# Altium schematic sheet SoM.SchDoc
size 420 x 297 mm; SheetNumber: 2; SheetTotal: 8
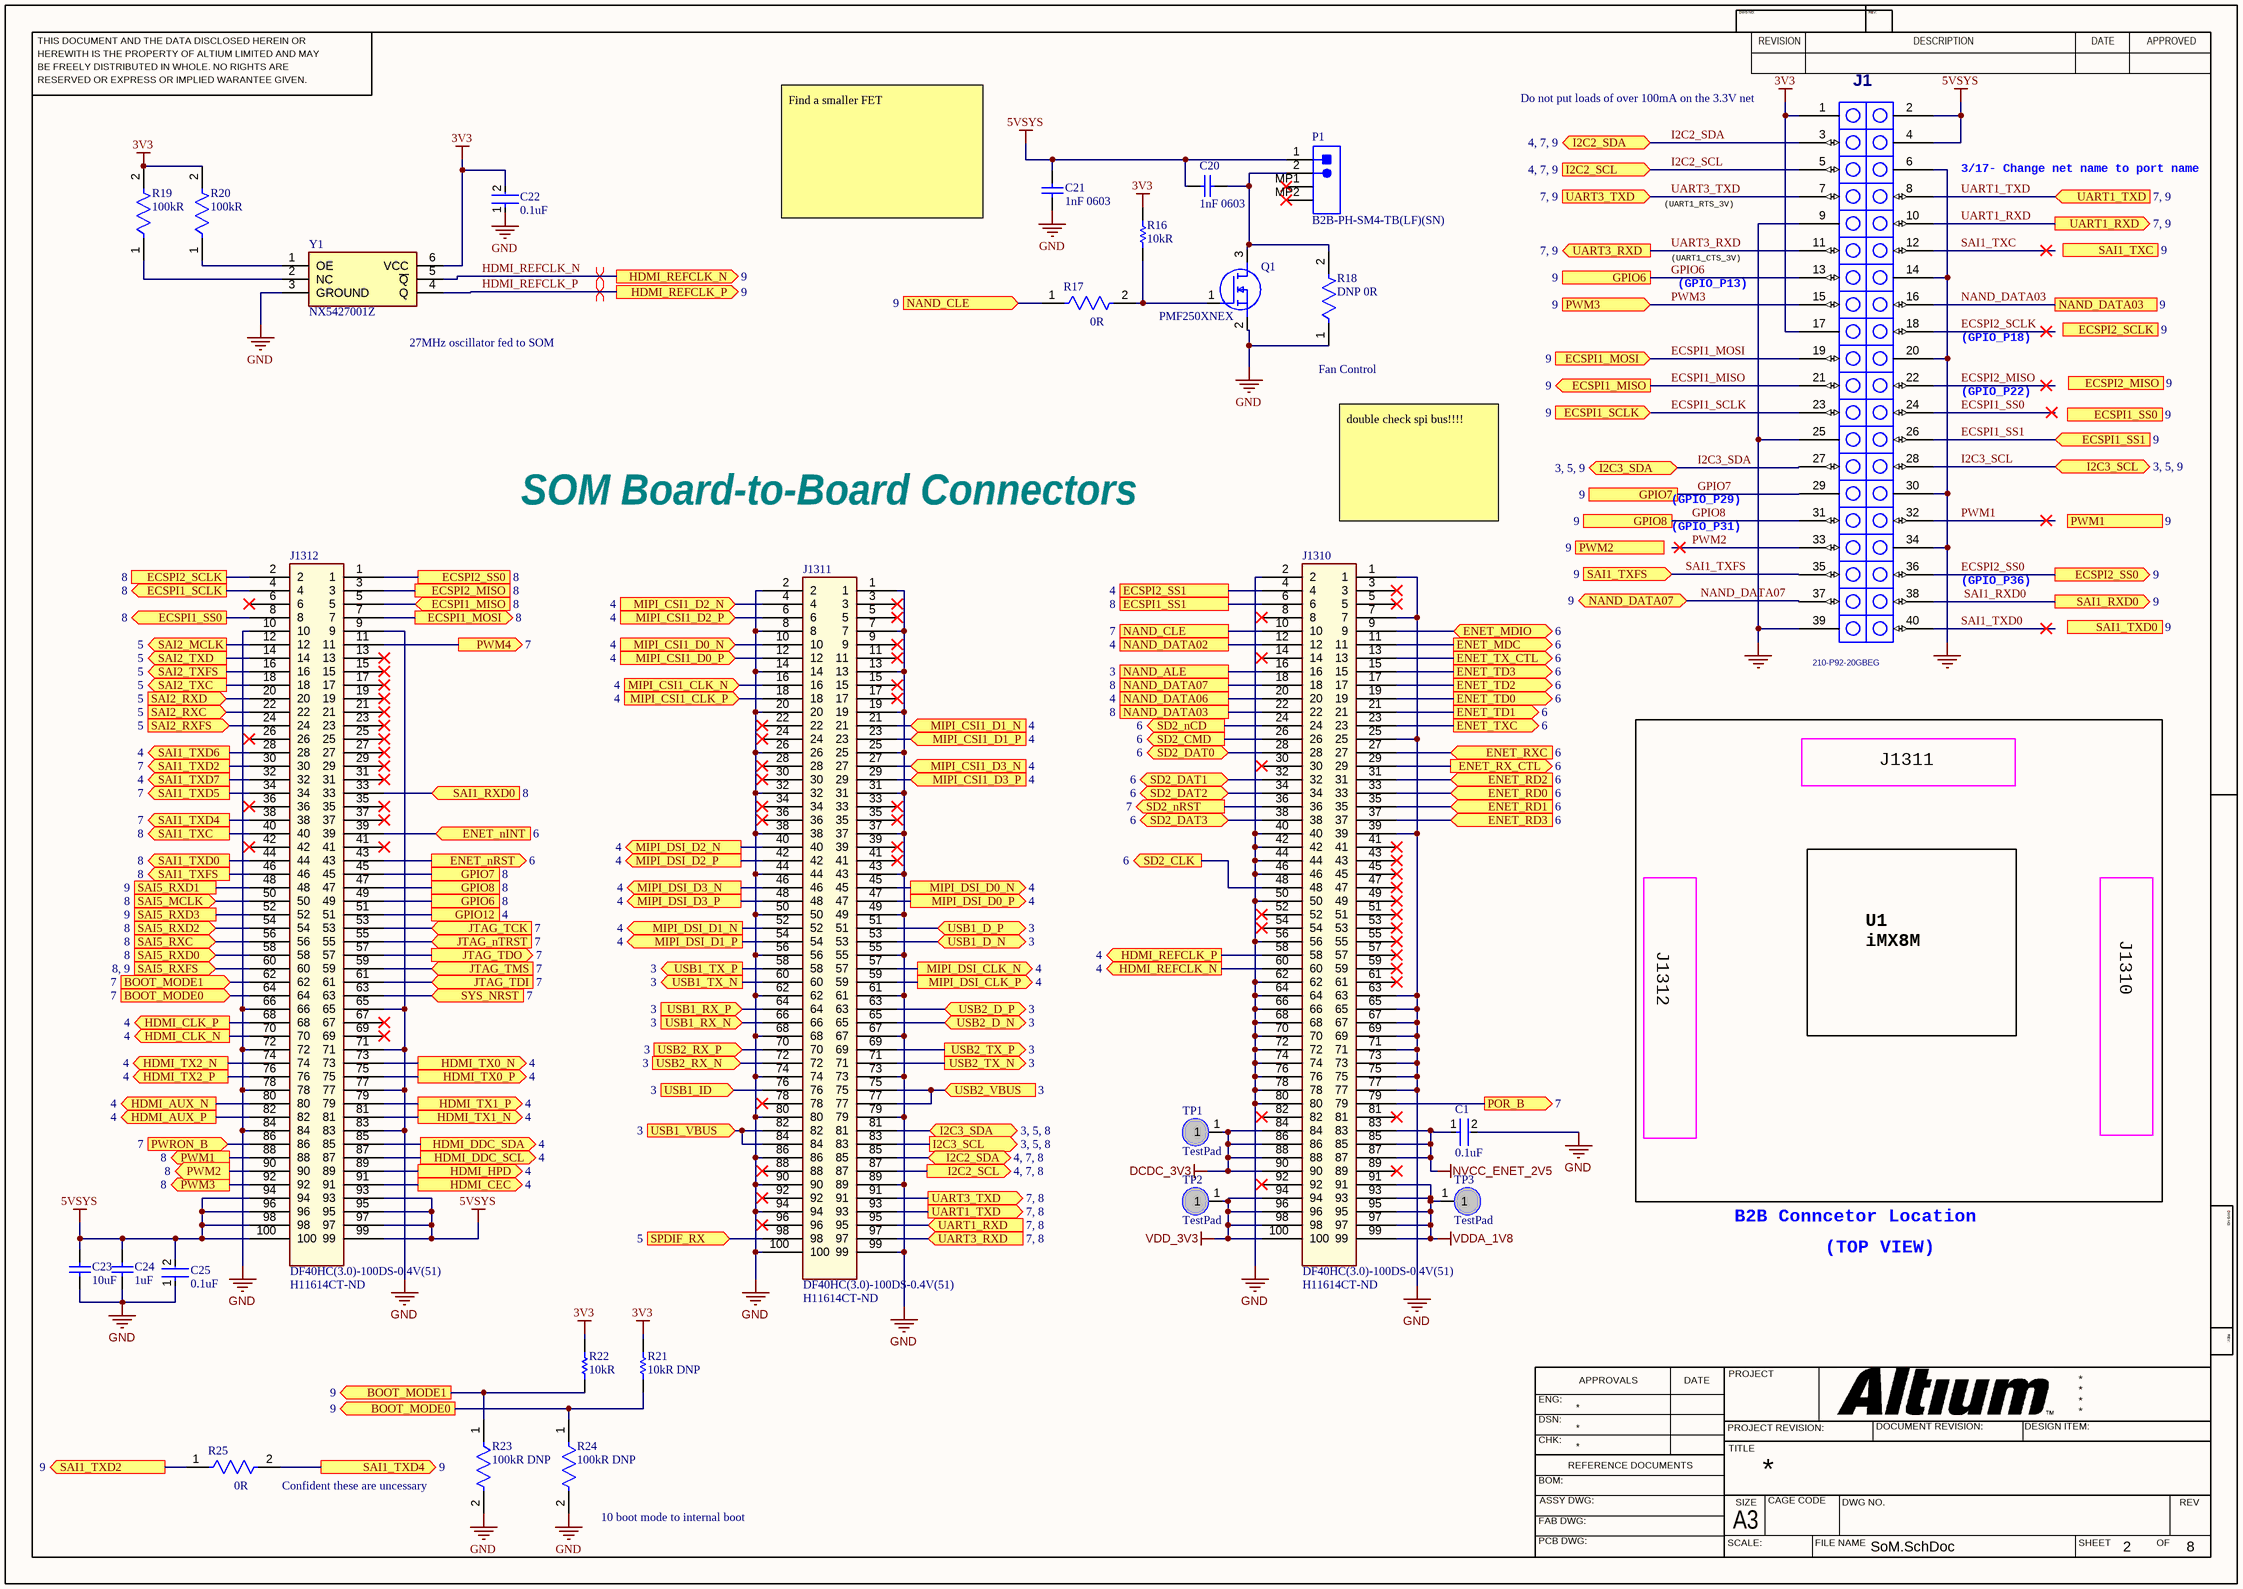
[diagram p0: SoM.SchDoc]

## Parts
C1  0.1uF  [FP-C0603-CJ-MFG]
C20  1nF 0603  [CAPC1608X90X35LL15T15]
C21  1nF 0603  [CAPC1608X90X35LL15T15]
C22  0.1uF  [FP-C0603-CJ-MFG]
C23  10uF  [CAPC2013X145X20ML20]
C24  1uF  [CAPC2013X145X50LL20T25]
C25  0.1uF  [FP-C0603-CJ-MFG]
J1  210-P92-20GBEG  [2X20]
J1310  DF40HC(3.0)-100DS-0.4V(51)  Supplier Part Number 1: H11614CT-ND  [DF40HC30100DS04V51]
J1311  DF40HC(3.0)-100DS-0.4V(51)  Supplier Part Number 1: H11614CT-ND  [DF40HC30100DS04V51]
J1312  DF40HC(3.0)-100DS-0.4V(51)  Supplier Part Number 1: H11614CT-ND  [DF40HC30100DS04V51]
P1  B2B-PH-SM4-TB(LF)(SN)  [JST-B2B-PH-SM4-TB-2_V]
Q1  PMF250XNEX  [SOT65P210X110-3N]
R16  10kR  [RESC2013X60X35NL10T20]
R17  0R  [FP-RC1206-MFG]
R18  DNP 0R  [FP-RC1206-MFG]
R19  100kR  [FP-RC0603-0_55-MFG]
R20  100kR  [FP-RC0603-0_55-MFG]
R21  10kR DNP  [RESC2013X60X35NL10T20]
R22  10kR  [RESC2013X60X35NL10T20]
R23  100kR DNP  [FP-RC0603-0_55-MFG]
R24  100kR DNP  [FP-RC0603-0_55-MFG]
R25  0R  [FP-RC1206-MFG]
TP1  TestPad  [TestPad50mil]
TP2  TestPad  [TestPad50mil]
TP3  TestPad  [TestPad50mil]
Y1  NX5427001Z  [NX5427001Z]

## Ports
BOOT_MODE0 (in, see 7), BOOT_MODE0 (out, see 9), BOOT_MODE1 (in, see 7), BOOT_MODE1 (out, see 9), ECSPI1_MISO (in, see 8), ECSPI1_MISO (out, see 9), ECSPI1_MOSI (in, see 9), ECSPI1_MOSI (out, see 8), ECSPI1_SCLK (in, see 9), ECSPI1_SCLK (out, see 8), ECSPI1_SS0 (in, see 9), ECSPI1_SS0 (out, see 8), ECSPI1_SS1 (in, see 9), ECSPI1_SS1 (see 8), ECSPI2_MISO (see 8), ECSPI2_MISO (see 9), ECSPI2_SCLK (see 8), ECSPI2_SCLK (see 9), ECSPI2_SS0 (out, see 9), ECSPI2_SS0 (see 8), ECSPI2_SS1 (see 4), ENET_MDC (out, see 6), ENET_MDIO (bidir, see 6), ENET_nINT (in, see 6), ENET_nRST (out, see 6), ENET_RD0 (in, see 6), ENET_RD1 (in, see 6), ENET_RD2 (in, see 6), ENET_RD3 (in, see 6), ENET_RX_CTL (out, see 6), ENET_RXC (in, see 6), ENET_TD0 (out, see 6), ENET_TD1 (out, see 6), ENET_TD2 (out, see 6), ENET_TD3 (out, see 6), ENET_TX_CTL (out, see 6), ENET_TXC (out, see 6), GPIO6 (see 8), GPIO6 (see 9), GPIO7 (see 8), GPIO7 (see 9), GPIO8 (see 8), GPIO8 (see 9), GPIO12 (see 4), HDMI_AUX_N (out, see 4), HDMI_AUX_P (out, see 4), HDMI_CEC (out, see 4), HDMI_CLK_N (out, see 4), HDMI_CLK_P (out, see 4), HDMI_DDC_SCL (out, see 4), HDMI_DDC_SDA (out, see 4), HDMI_HPD (out, see 4), HDMI_REFCLK_N (out, see 4), HDMI_REFCLK_N (out, see 9), HDMI_REFCLK_P (out, see 4), HDMI_REFCLK_P (out, see 9), HDMI_TX0_N (out, see 4), HDMI_TX0_P (out, see 4), HDMI_TX1_N (out, see 4), HDMI_TX1_P (out, see 4), HDMI_TX2_N (out, see 4), HDMI_TX2_P (out, see 4), I2C2_SCL (in, see 4, 7, 9), I2C2_SCL (out, see 4, 7, 8), I2C2_SDA (bidir, see 4, 7, 8), I2C2_SDA (bidir, see 4, 7, 9), I2C3_SCL (bidir, see 3, 5, 9), I2C3_SCL (out, see 3, 5, 8), I2C3_SDA (bidir, see 3, 5, 8), I2C3_SDA (bidir, see 3, 5, 9), JTAG_nTRST (in, see 7), JTAG_TCK (in, see 7), JTAG_TDI (in, see 7), JTAG_TDO (out, see 7), JTAG_TMS (in, see 7), MIPI_CSI1_CLK_N (in, see 4), MIPI_CSI1_CLK_P (in, see 4), MIPI_CSI1_D0_N (in, see 4), MIPI_CSI1_D0_P (in, see 4), MIPI_CSI1_D1_N (in, see 4), MIPI_CSI1_D1_P (in, see 4), MIPI_CSI1_D2_N (in, see 4), MIPI_CSI1_D2_P (in, see 4), MIPI_CSI1_D3_N (in, see 4), MIPI_CSI1_D3_P (in, see 4), MIPI_DSI_CLK_N (out, see 4), MIPI_DSI_CLK_P (out, see 4), MIPI_DSI_D0_N (out, see 4), MIPI_DSI_D0_P (out, see 4), MIPI_DSI_D1_N (out, see 4), MIPI_DSI_D1_P (out, see 4), MIPI_DSI_D2_N (out, see 4), MIPI_DSI_D2_P (out, see 4), MIPI_DSI_D3_N (out, see 4), MIPI_DSI_D3_P (out, see 4), NAND_ALE (see 3), NAND_CLE (in, see 9), NAND_CLE (see 7), NAND_DATA02 (see 4), NAND_DATA03 (see 8), NAND_DATA03 (see 9), NAND_DATA06 (see 4), NAND_DATA07 (bidir, see 9), NAND_DATA07 (see 8), POR_B (out, see 7), PWM1 (in, see 9), PWM1 (out, see 8), PWM2 (in, see 9), PWM2 (out, see 8), PWM3 (in, see 9), PWM3 (out, see 8), PWM4 (out, see 7), PWRON_B (in, see 7), SAI1_RXD0 (in, see 8), SAI1_RXD0 (out, see 9), SAI1_TXC (in, see 9), SAI1_TXC (out, see 8), SAI1_TXD0 (out, see 8), SAI1_TXD0 (out, see 9), SAI1_TXD2 (out, see 7), SAI1_TXD2 (out, see 9), SAI1_TXD4 (out, see 7), SAI1_TXD4 (out, see 9), SAI1_TXD5 (out, see 7), SAI1_TXD6 (out, see 4), SAI1_TXD7 (out, see 4), SAI1_TXFS (in, see 9), SAI1_TXFS (out, see 8), SAI2_MCLK (out, see 5), SAI2_RXC (in, see 5), SAI2_RXD (in, see 5), SAI2_RXFS (in, see 5), SAI2_TXC (out, see 5), SAI2_TXD (out, see 5), SAI2_TXFS (out, see 5), SAI5_MCLK (in, see 8), SAI5_RXC (in, see 8), SAI5_RXD0 (in, see 8), SAI5_RXD1 (see 9), SAI5_RXD2 (in, see 8), SAI5_RXD3 (see 9), SAI5_RXFS (in, see 8, 9), SD2_CLK (out, see 6), SD2_CMD (out, see 6), SD2_DAT0 (bidir, see 6), SD2_DAT1 (bidir, see 6), SD2_DAT2 (bidir, see 6), SD2_DAT3 (bidir, see 6), SD2_nCD (out, see 6), SD2_nRST (out, see 7), SPDIF_RX (in, see 5), SYS_NRST (in, see 7), UART1_RXD (in, see 7, 8), UART1_RXD (out, see 7, 9), UART1_TXD (in, see 7, 9), UART1_TXD (out, see 7, 8), UART3_RXD (in, see 7, 8), UART3_RXD (out, see 7, 9), UART3_TXD (in, see 7, 9), UART3_TXD (out, see 7, 8), USB1_D_N (bidir, see 3), USB1_D_P (bidir, see 3), USB1_ID (in, see 3), USB1_RX_N (in, see 3), USB1_RX_P (in, see 3), USB1_TX_N (out, see 3), USB1_TX_P (out, see 3), USB1_VBUS (in, see 3), USB2_D_N (bidir, see 3), USB2_D_P (bidir, see 3), USB2_RX_N (in, see 3), USB2_RX_P (in, see 3), USB2_TX_N (out, see 3), USB2_TX_P (out, see 3), USB2_VBUS (in, see 3)

## Nets
3V3: C22.2 J1.1 J1.17 R16.1 R19.2 R20.2 R21.1 R22.1 Y1.6(VCC)
5VSYS: C20.2 C21.1 C23.2 C24.2 C25.2 J1.2 J1.4 J1312.93 J1312.94 J1312.95 J1312.96 J1312.97 J1312.98 J1312.99 J1312.100 P1.1
DCDC_3V3: J1310.84 J1310.86 J1310.88 J1310.90 TP1.1
GND: C1.2 C21.2 C22.1 C23.1 C24.1 C25.1 J1.6 J1.9 J1.14 J1.20 J1.25 J1.30 J1.34 J1.39 J1310.1 J1310.2 J1310.7 J1310.25 J1310.39 J1310.40 J1310.42 J1310.44 J1310.46 J1310.50 J1310.56 J1310.62 J1310.63 J1310.64 J1310.65 J1310.66 J1310.67 J1310.68 J1310.69 J1310.70 J1310.71 J1310.72 J1310.73 J1310.74 J1310.75 J1310.76 J1310.77 J1310.78 J1310.80 J1311.1 J1311.2 J1311.7 J1311.8 J1311.13 J1311.14 J1311.19 J1311.20 J1311.25 J1311.26 J1311.31 J1311.32 J1311.37 J1311.38 J1311.43 J1311.44 J1311.49 J1311.50 J1311.55 J1311.56 J1311.61 J1311.62 J1311.67 J1311.68 J1311.73 J1311.74 J1311.79 J1311.80 J1311.86 J1311.89 J1311.90 J1311.94 J1311.99 J1311.100 J1312.9 J1312.10 J1312.65 J1312.66 J1312.71 J1312.72 J1312.77 J1312.78 J1312.83 J1312.84 Q1.2(S) R18.1 R23.2 R24.2 Y1.3(GROUND)
NVCC_ENET_2V5: C1.1 J1310.83 J1310.85 J1310.87
VDD_3V3: J1310.94 J1310.96 J1310.98 J1310.100 TP2.1
VDDA_1V8: J1310.91 J1310.93 J1310.95 J1310.97 J1310.99 TP3.1
BOOT_MODE0: J1312.64 R21.2 R24.1 ; port BOOT_MODE0
BOOT_MODE1: J1312.62 R22.2 R23.1 ; port BOOT_MODE1
ECSPI1_MISO: J1.21 J1312.5 ; port ECSPI1_MISO
ECSPI1_MOSI: J1.19 J1312.7 ; port ECSPI1_MOSI
ECSPI1_SCLK: J1.23 J1312.4 ; port ECSPI1_SCLK
ECSPI1_SS0: J1312.8 ; port ECSPI1_SS0
ECSPI1_SS0: J1.24  [a separate net that carries the same name]
ECSPI1_SS1: J1.26 J1310.6 ; port ECSPI1_SS1
ECSPI2_MISO: J1312.3 ; port ECSPI2_MISO
ECSPI2_MISO: J1.22  [a separate net that carries the same name]
ECSPI2_SCLK: J1312.2 ; port ECSPI2_SCLK
ECSPI2_SCLK: J1.18  [a separate net that carries the same name]
ECSPI2_SS0: J1.36 J1312.1 ; port ECSPI2_SS0
ECSPI2_SS1: J1310.4 ; port ECSPI2_SS1
ENET_MDC: J1310.11 ; port ENET_MDC
ENET_MDIO: J1310.9 ; port ENET_MDIO
ENET_nINT: J1312.39 ; port ENET_nINT
ENET_nRST: J1312.43 ; port ENET_nRST
ENET_RD0: J1310.33 ; port ENET_RD0
ENET_RD1: J1310.35 ; port ENET_RD1
ENET_RD2: J1310.31 ; port ENET_RD2
ENET_RD3: J1310.37 ; port ENET_RD3
ENET_RX_CTL: J1310.29 ; port ENET_RX_CTL
ENET_RXC: J1310.27 ; port ENET_RXC
ENET_TD0: J1310.19 ; port ENET_TD0
ENET_TD1: J1310.21 ; port ENET_TD1
ENET_TD2: J1310.17 ; port ENET_TD2
ENET_TD3: J1310.15 ; port ENET_TD3
ENET_TX_CTL: J1310.13 ; port ENET_TX_CTL
ENET_TXC: J1310.23 ; port ENET_TXC
GPIO6: J1.13 J1312.49 ; port GPIO6
GPIO7: J1.29 J1312.45 ; port GPIO7
GPIO8: J1.31 J1312.47 ; port GPIO8
GPIO12: J1312.51 ; port GPIO12
HDMI_AUX_N: J1312.80 ; port HDMI_AUX_N
HDMI_AUX_P: J1312.82 ; port HDMI_AUX_P
HDMI_CEC: J1312.91 ; port HDMI_CEC
HDMI_CLK_N: J1312.70 ; port HDMI_CLK_N
HDMI_CLK_P: J1312.68 ; port HDMI_CLK_P
HDMI_DDC_SCL: J1312.87 ; port HDMI_DDC_SCL
HDMI_DDC_SDA: J1312.85 ; port HDMI_DDC_SDA
HDMI_HPD: J1312.89 ; port HDMI_HPD
HDMI_REFCLK_N: J1310.60 Y1.5(~{Q}) ; port HDMI_REFCLK_N
HDMI_REFCLK_P: J1310.58 Y1.4(Q) ; port HDMI_REFCLK_P
HDMI_TX0_N: J1312.73 ; port HDMI_TX0_N
HDMI_TX0_P: J1312.75 ; port HDMI_TX0_P
HDMI_TX1_N: J1312.81 ; port HDMI_TX1_N
HDMI_TX1_P: J1312.79 ; port HDMI_TX1_P
HDMI_TX2_N: J1312.74 ; port HDMI_TX2_N
HDMI_TX2_P: J1312.76 ; port HDMI_TX2_P
I2C2_SCL: J1.5 J1311.87 ; port I2C2_SCL
I2C2_SDA: J1.3 J1311.85 ; port I2C2_SDA
I2C3_SCL: J1.28 J1311.83 ; port I2C3_SCL
I2C3_SDA: J1.27 J1311.81 ; port I2C3_SDA
JTAG_nTRST: J1312.55 ; port JTAG_nTRST
JTAG_TCK: J1312.53 ; port JTAG_TCK
JTAG_TDI: J1312.61 ; port JTAG_TDI
JTAG_TDO: J1312.57 ; port JTAG_TDO
JTAG_TMS: J1312.59 ; port JTAG_TMS
MIPI_CSI1_CLK_N: J1311.16 ; port MIPI_CSI1_CLK_N
MIPI_CSI1_CLK_P: J1311.18 ; port MIPI_CSI1_CLK_P
MIPI_CSI1_D0_N: J1311.10 ; port MIPI_CSI1_D0_N
MIPI_CSI1_D0_P: J1311.12 ; port MIPI_CSI1_D0_P
MIPI_CSI1_D1_N: J1311.21 ; port MIPI_CSI1_D1_N
MIPI_CSI1_D1_P: J1311.23 ; port MIPI_CSI1_D1_P
MIPI_CSI1_D2_N: J1311.4 ; port MIPI_CSI1_D2_N
MIPI_CSI1_D2_P: J1311.6 ; port MIPI_CSI1_D2_P
MIPI_CSI1_D3_N: J1311.27 ; port MIPI_CSI1_D3_N
MIPI_CSI1_D3_P: J1311.29 ; port MIPI_CSI1_D3_P
MIPI_DSI_CLK_N: J1311.57 ; port MIPI_DSI_CLK_N
MIPI_DSI_CLK_P: J1311.59 ; port MIPI_DSI_CLK_P
MIPI_DSI_D0_N: J1311.45 ; port MIPI_DSI_D0_N
MIPI_DSI_D0_P: J1311.47 ; port MIPI_DSI_D0_P
MIPI_DSI_D1_N: J1311.52 ; port MIPI_DSI_D1_N
MIPI_DSI_D1_P: J1311.54 ; port MIPI_DSI_D1_P
MIPI_DSI_D2_N: J1311.40 ; port MIPI_DSI_D2_N
MIPI_DSI_D2_P: J1311.42 ; port MIPI_DSI_D2_P
MIPI_DSI_D3_N: J1311.46 ; port MIPI_DSI_D3_N
MIPI_DSI_D3_P: J1311.48 ; port MIPI_DSI_D3_P
NAND_ALE: J1310.16 ; port NAND_ALE
NAND_CLE: J1310.10 R17.1 ; port NAND_CLE
NAND_DATA02: J1310.12 ; port NAND_DATA02
NAND_DATA03: J1.16 J1310.22 ; port NAND_DATA03
NAND_DATA06: J1310.20 ; port NAND_DATA06
NAND_DATA07: J1.37 J1310.18 ; port NAND_DATA07
POR_B: J1310.79 ; port POR_B
PWM1: J1312.88 ; port PWM1
PWM1: J1.32  [a separate net that carries the same name]
PWM2: J1312.90 ; port PWM2
PWM2: J1.33  [a separate net that carries the same name]
PWM3: J1.15 J1312.92 ; port PWM3
PWM4: J1312.11 ; port PWM4
PWRON_B: J1312.86 ; port PWRON_B
SAI1_RXD0: J1.38 J1312.33 ; port SAI1_RXD0
SAI1_TXC: J1312.40 ; port SAI1_TXC
SAI1_TXC: J1.12  [a separate net that carries the same name]
SAI1_TXD0: J1312.44 ; port SAI1_TXD0
SAI1_TXD0: J1.40  [a separate net that carries the same name]
SAI1_TXD2: J1312.30 R25.1 ; port SAI1_TXD2
SAI1_TXD4: J1312.38 R25.2 ; port SAI1_TXD4
SAI1_TXD5: J1312.34 ; port SAI1_TXD5
SAI1_TXD6: J1312.28 ; port SAI1_TXD6
SAI1_TXD7: J1312.32 ; port SAI1_TXD7
SAI1_TXFS: J1.35 J1312.46 ; port SAI1_TXFS
SAI2_MCLK: J1312.12 ; port SAI2_MCLK
SAI2_RXC: J1312.22 ; port SAI2_RXC
SAI2_RXD: J1312.20 ; port SAI2_RXD
SAI2_RXFS: J1312.24 ; port SAI2_RXFS
SAI2_TXC: J1312.18 ; port SAI2_TXC
SAI2_TXD: J1312.14 ; port SAI2_TXD
SAI2_TXFS: J1312.16 ; port SAI2_TXFS
SAI5_MCLK: J1312.50 ; port SAI5_MCLK
SAI5_RXC: J1312.56 ; port SAI5_RXC
SAI5_RXD0: J1312.58 ; port SAI5_RXD0
SAI5_RXD1: J1312.48 ; port SAI5_RXD1
SAI5_RXD2: J1312.54 ; port SAI5_RXD2
SAI5_RXD3: J1312.52 ; port SAI5_RXD3
SAI5_RXFS: J1312.60 ; port SAI5_RXFS
SD2_CLK: J1310.48 ; port SD2_CLK
SD2_CMD: J1310.26 ; port SD2_CMD
SD2_DAT0: J1310.28 ; port SD2_DAT0
SD2_DAT1: J1310.32 ; port SD2_DAT1
SD2_DAT2: J1310.34 ; port SD2_DAT2
SD2_DAT3: J1310.38 ; port SD2_DAT3
SD2_nCD: J1310.24 ; port SD2_nCD
SD2_nRST: J1310.36 ; port SD2_nRST
SPDIF_RX: J1311.98 ; port SPDIF_RX
SYS_NRST: J1312.63 ; port SYS_NRST
UART1_RXD: J1.10 J1311.95 ; port UART1_RXD
UART1_TXD: J1.8 J1311.93 ; port UART1_TXD
UART3_RXD: J1.11 J1311.97 ; port UART3_RXD
UART3_TXD: J1.7 J1311.91 ; port UART3_TXD
USB1_D_N: J1311.53 ; port USB1_D_N
USB1_D_P: J1311.51 ; port USB1_D_P
USB1_ID: J1311.76 ; port USB1_ID
USB1_RX_N: J1311.66 ; port USB1_RX_N
USB1_RX_P: J1311.64 ; port USB1_RX_P
USB1_TX_N: J1311.60 ; port USB1_TX_N
USB1_TX_P: J1311.58 ; port USB1_TX_P
USB1_VBUS: J1311.82 J1311.84 ; port USB1_VBUS
USB2_D_N: J1311.65 ; port USB2_D_N
USB2_D_P: J1311.63 ; port USB2_D_P
USB2_RX_N: J1311.72 ; port USB2_RX_N
USB2_RX_P: J1311.70 ; port USB2_RX_P
USB2_TX_N: J1311.71 ; port USB2_TX_N
USB2_TX_P: J1311.69 ; port USB2_TX_P
USB2_VBUS: J1311.75 J1311.77 ; port USB2_VBUS
NetC20_1: C20.1 P1.2 Q1.3(D) R18.2
NetQ1_1: Q1.1(G) R16.2 R17.2
NetR19_1: R19.1 Y1.2(NC)
NetR20_1: R20.1 Y1.1(OE)

Not connected (* = marked no-connect by the designer): J1310 3* 5* 8* 14* 30* 41* 43* 45* 47* 49* 51* 52* 53* 54* 55* 57* 59* 61* 81* 82* 89* 92*; J1311 3* 5* 9* 11* 15* 17* 22* 24* 28* 30* 33* 34* 35* 36* 39* 41* 78* 88* 92* 96*; J1312 6* 13* 15* 17* 19* 21* 23* 25* 26* 27* 29* 31* 35* 36* 37* 41* 42* 67* 69*; P1 MP1* MP2*

## Layout directives
differential pair: HDMI_REFCLK_N, HDMI_REFCLK_P

## Notes on the sheet
- (near J1) Do not put loads of over 100mA on the 3.3V net
- 3/17- Change net name to port name
- Find a smaller FET
- (UART1_RTS_3V)
- (UART1_CTS_3V)
- (GPIO_P13)
- (near Y1) 27MHz oscillator fed to SOM
- (near R18) Fan Control
- (GPIO_P18)
- (GPIO_P22)
- SOM Board-to-Board Connectors
- double check spi bus!!!!
- (GPIO_P31)
- (GPIO_P29)
- (GPIO_P36)
- J1311
- J1310
- J1312
- U1
  iMX8M
- B2B Conncetor Location
- (TOP VIEW)
- Confident these are uncessary
- (near R24) 10 boot mode to internal boot
- THIS DOCUMENT AND THE DATA DISCLOSED HEREIN OR
- HEREWITH IS THE PROPERTY OF ALTIUM LIMITED AND MAY
- DWG NO:
- REVISION
- REV:
- DESCRIPTION
- DATE
- APPROVED
- BE FREELY DISTRIBUTED IN WHOLE. NO RIGHTS ARE
- RESERVED OR EXPRESS OR IMPLIED WARANTEE GIVEN.
- ENG:
- APPROVALS
- PROJECT
- DSN:
- CHK:
- REFERENCE DOCUMENTS
- PROJECT REVISION:
- TITLE
- DOCUMENT REVISION:
- DESIGN ITEM:
- BOM:
- FAB DWG:
- PCB DWG:
- ASSY DWG:
- SCALE:
- A3
- SIZE
- CAGE CODE
- FILE NAME
- DWG NO.
- SHEET
- OF
- REV

## Library data of the parts
C1 C22 C25 = CMP-2006-03300-2: C0603X104K5RACTU CAP CER 0.1UF 50V X7R 0603; Manufacturer: Kemet; Capacitance: 100nF; Material: Ceramic; Tolerance: 10%; Value: 100nF; Temperature Coefficient: 15%; Temperature Range High: +125°C; Temperature Range Low: -55°C; Manufacturer Part Number: C0603X104K5RACTU; Voltage: 50V; ComponentLink2Description: Datasheet; RoHS: TRUE; ComponentLink2URL: https://content.kemet.com/datasheets/KEM_C1013_X7R_FT-CAP_SMD.pdf; Device Class L3: Ceramic Capacitors; Device Class L2: Capacitors; Package: C0603-CJ; Height: 0.95mm; Device Class L1: Passive Components; Temperature Characteristic: X7R; Lead Free: Yes; Digikey Description: CAP CER 0.1UF 50V X7R 0603; Automotive: No; Mouser Description: Capacitor; Ceramic; Cap 0.1uF; Tol+10%; SMT; Flexible Termination; Vol-Rtg 50V; TR; Temperature: -55°C to +125°C; Octopart: https://octopart.com/c0603x104k5ractu-kemet-9145062; Category: Cap; Voltage Rating: 50V; Ipc Land Pattern Name: CAPC16080X80
C20 C21 = CMP-2006-04378-1: 06035C102KAT2A; Manufacturer: AVX Interconnect / Elco; Part Number: 06035C102KAT2A
C23 = CMP-2000-05452-1: C2012X7R1A106K125AC Multilayer Ceramic Chip Capacitor, 10 uF, +/- 10%, 10 V, -55 to 125 degC, 0805 (2012 Metric), RoHS, Tape and Reel; Manufacturer: TDK; PCN Part Number: MLCCPartNumberChange30/Nov/2012; Capacitance: 10µF; Voltage - Rated: 10V; Product Training Modules: CSeriesGeneralApplicationsSEAT,CCV,andTVCLDesignToolsGuidetoReplacinganElectrolyticCapacitorwithanMLCC; Online Catalog: CSeries,GeneralPurpose; Other Names: 445-6857-6; Temperature Coefficient: X7R; Features: -; Ratings: -; Operating Temperature: -55degC~125degC; RoHS Information: RoHSCertificate-MLCC; Datasheet Version: Mar-15; Package / Case: 0805(2012Metric); Series: C; Mounting Type: SurfaceMount,MLCC; Family: CeramicCapacitors; Height - Seated (Max): -; Manufacturer URL: http://www.tdk.com/; Packaging: Digi-Reel; Tolerance: ±10%; Category: Capacitors; Applications: GeneralPurpose; Standard Package: 1; Size / Dimension: 0.079"Lx0.049"W(2.00mmx1.25mm); Datasheet URL: http://download.siliconexpert.com/pdfs/2015/4/21/15/54/45/779/tdk_/manual/37024850441143360mlcc_commercial_general_en.pdf; Lead Style: -; Lead Spacing: -; Thickness (Max): 0.057"(1.45mm); Package Reference: 805; Package Description: 2-Pin Surface Mount Device, Body 2 x 1.25 mm
C24 = CMP-1036-04746-2: C0805C105K4PACTU; Manufacturer: Kemet; Part Number: C0805C105K4PACTU
J1 = CONN_HEADER_20x2_SMT: SOCKET 2X20 100-MIL STRAIGHT SMT; Function Code: DOK; QPN: DFHD20MS161; QPN Description: CONN DIP HEADER 20P 2R MS(P2.54,H8.3); Supplier 1: Samtec; Supplier Part Number 1: 210-P92-20GBEG; MPN: 210-P92-20GBEG; QCI MPN: 210-P92-20GBEG; QCI Supplier: PRX
J1310-J1312 = CONN_HIROSE-DF40C-100DP-0.4V(51): CONN HDR 100POS 0.4MM SMD GOLD; Function Code: DOK; QPN: DFHSA0FR017; QPN Description: CONN HOUSING 100P 2R FR(P0.4,H2.9); QCI Supplier: HRS; Supplier 1: Digi-Key; MPN: DF40HC(3.0)-100DS-0.4V(51); QCI MPN: DF40HC(3.0)-100DS-0.4V(51)
P1 = CMP-2000-05163-1: Male Header, Pitch 2 mm, 1 x 2 Position, Height 6.6 mm, RoHS, Tape and Reel; Manufacturer: JST; No of Positions: 2; Style/Orientation: StraightHeader/Plug; Pitch: 2mm; Datasheet URL: https://ciiva.com/datasheet-click-26894756?src=ciiva&sig=90099765; Termination: Crimp; Manufacturer URL: http://www.jst.com/home2.html; Type: ShroudedHeader; Datasheet Version: Dec-12
Q1 = PMF250XNEX: MOSFET (N-Channel); Manufacturer_Name: Nexperia; Datasheet Link: https://assets.nexperia.com/documents/data-sheet/PMF250XNE.pdf; Height: 1.1mm; Manufacturer_Part_Number: PMF250XNEX; Mouser Part Number: 771-PMF250XNEX; Mouser Price/Stock: https://www.mouser.co.uk/ProductDetail/Nexperia/PMF250XNEX?qs=gH1BdSMZm8Un6H8hz1cFsw%3D%3D; Arrow Part Number: PMF250XNEX; Arrow Price/Stock: https://www.arrow.com/en/products/pmf250xnex/nexperia
R16 R21 R22 = CMP-1659-00013-4: RC0805FR-0710KL Chip Resistor, 10 KOhm, +/- 1%, 0.125 W, -55 to 155 degC, 0805 (2012 Metric), RoHS, Tape and Reel; Manufacturer: Yageo; Voltage Rating: 150 V; Mount: Surface Mount; ComponentLink1Description: Manufacturer URL; ComponentLink2URL: http://www.yageo.com/documents/recent/PYu-RC_Group_51_RoHS_L_04.pdf; Pins: 2; Length: 2 mm; Min Operating Temperature: -55 degC; Height: 0.5 mm; Mounting Technology: Surface Mount; RoHSCompliant: true; REACH SVHC: No SVHC; ComponentLink1URL: http://www.yageo.com/; Max Operating Temperature: 155 degC; PackageReference: 0805; DatasheetVersion: Rev. 4, 02/2016; Package Quantity: 5000; Packaging: Tape and Reel; ComponentLink2Description: Datasheet; PackageDescription: 2-Pin Surface Mounted Device, Body 2 x 1.25 mm
R17 R18 R25 = CMP-2100-03681-2: RC1206JR-070RL RES SMD 0 OHM JUMPER 1/4W 1206; Manufacturer: YAGEO; Voltage Rating: 200V; Temperature Coefficient: 300ppm/°C; Power Rating: 0.25W; Value: 0Ω; Tolerance: 5%; Manufacturer Part Number: RC1206JR-070RL; Temperature Range Low: -55°C; Category: Res; Automotive: No; Ipc Land Pattern Name: RESC310160X55; Device Class L1: Passive Components; Temperature: -55°C to +155°C; ComponentLink2URL: https://www.yageo.com/upload/media/product/productsearch/datasheet/rchip/PYu-RC_Group_51_RoHS_L_10.pdf; Lead Free: Yes; Height: 0.65mm; Footprint Url: https://www.yageo.com/upload/website/yageo_PYu-R_Mount_10_19050818_343.pdf; Package: RC1206; Digikey Description: RES SMD 0 OHM JUMPER 1/4W 1206; Temperature Range High: +155°C; Device Class L3: Chip SMD Resistors; Device Class L2: Resistors; Octopart: https://octopart.com/rc1206jr-070rl-yageo-40025601; Resistance: 0Ω; Series: RC; ComponentLink2Description: Datasheet; Composition: Thick Film; RoHS: TRUE; Mouser Description: Resistor: thick film; SMD; 1206; 0O; 0.25W; ±5%; -55÷155°C
R19 R20 R23 R24 = CMP-2100-03662-2: RC0603FR-07100KL RES SMD 100K OHM 1% 1/10W 0603; Voltage Rating (DC): 50V; Max Power Dissipation: 100mW; Temperature Coefficient: 100ppm/°C; Working Voltage: 75V; Length: 1.6mm; Lead Free: Lead Free; Number of Terminations: 2; Packaging: Tape and Reel; Voltage Rating: 50V; Termination: SMD/SMT; Width: 0.8mm; Resistance: 100kR; Resistor Type: Thick Film; Resistance Tolerance: 1%; Features: Moisture Resistant; Height: 0.45mm; Construction: Rectangular; Case/Package: 0603; Military Standard: Not; Case Code (Imperial): 0603; Series: RC; Technology: THICK FILM; Depth: 0.8mm; RoHS Compliant: Yes; REACH SVHC: No SVHC; Min Operating Temperature: -55°C; Case Code (Metric): 1608; Max Operating Temperature: 155°C; Power Rating: 100mW; Number of Pins: 2; Tolerance: 1%
Y1 = NX5427001Z: Crystal or Oscillator; Manufacturer_Name: Diodes Inc.; Datasheet Link: https://www.mouser.com/datasheet/2/115/X5427001Z-1536397.pdf; Height: 1.35mm; Manufacturer_Part_Number: NX5427001Z; Mouser Part Number: 729-NX5427001Z; Mouser Price/Stock: https://www.mouser.co.uk/ProductDetail/Diodes-Incorporated/NX5427001Z/?qs=wUXugUrL1qyVL74uDcbXrg%3D%3D; Arrow Part Number: NX5427001Z; Arrow Price/Stock: https://www.arrow.com/en/products/nx5427001z/diodes-incorporated